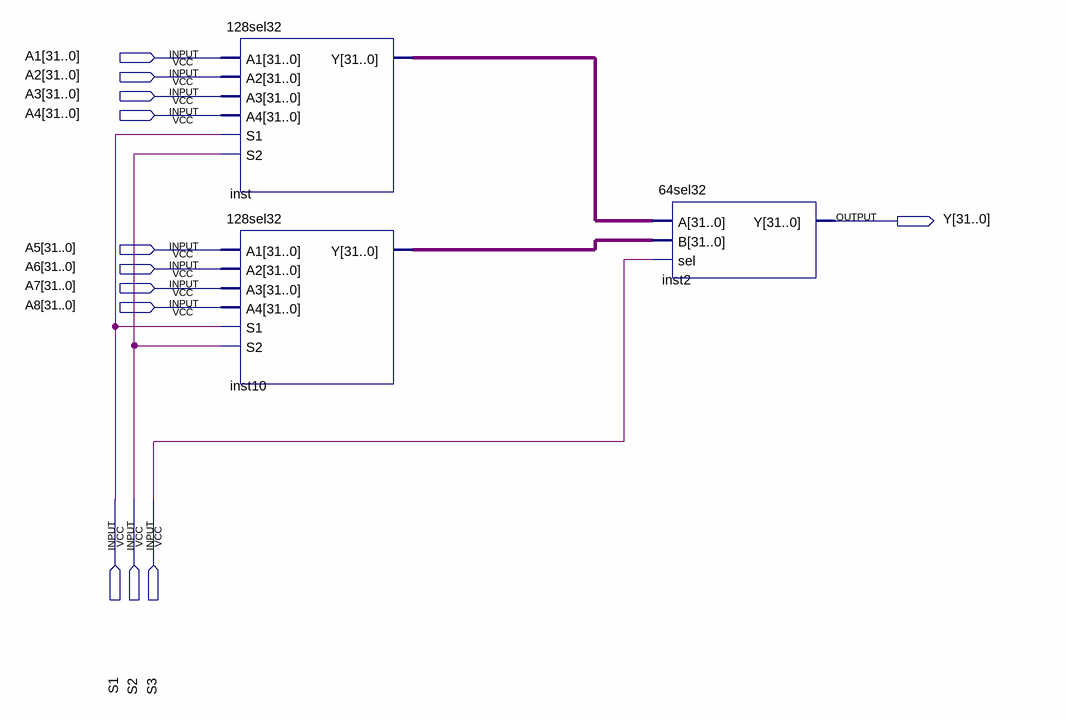
[diagram p0: schematic sheet]
// Quartus schematic 256sel32.bdf as structural Verilog: 3 symbols, 12 pins
module \256sel32  (
  input  [31:0] A1,
  input  [31:0] A2,
  input  [31:0] A3,
  input  [31:0] A4,
  input  [31:0] A5,
  input  [31:0] A6,
  input  [31:0] A7,
  input  [31:0] A8,
  input  S1,
  input  S2,
  input  S3,
  output [31:0] Y
);

  wire [31:0] inst10_y, inst_y;

  \128sel32  inst (.A1(A1), .A2(A2), .A3(A3), .A4(A4), .S1(S1), .S2(S2), .Y(inst_y));
  \128sel32  inst10 (.A1(A5), .A2(A6), .A3(A7), .A4(A8), .S1(S1), .S2(S2), .Y(inst10_y));
  \64sel32  inst2 (.A(inst_y), .B(inst10_y), .sel(S3), .Y(Y));
endmodule
